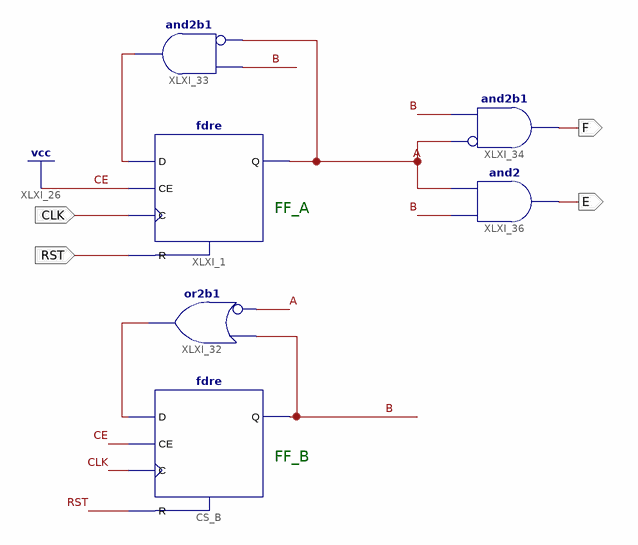
[diagram p0: schematic sheet 1]
// Xilinx ISE schematic sequencer.sch (spartan3e) as structural Verilog: 6 symbols, 4 ports
module sequencer (
  input  RST,
  input  CLK,
  output E,
  output F
);

  wire A, B, XLXN_116, XLXN_119;

  fdre XLXI_1 (.C(CLK), .CE(1'b1), .D(XLXN_119), .R(RST), .Q(A));
  fdre CS_B (.C(CLK), .CE(1'b1), .D(XLXN_116), .R(RST), .Q(B));
  or XLXI_32 (XLXN_116, ~A, B);  // or2b1
  and XLXI_33 (XLXN_119, ~A, B);  // and2b1
  and XLXI_34 (F, ~A, B);  // and2b1
  and XLXI_36 (E, B, A);

  // Notes on the sheet:
  //   FF_A
  //   FF_B
endmodule
